# EAGLE design mainboard (EAGLE 9.6.2)
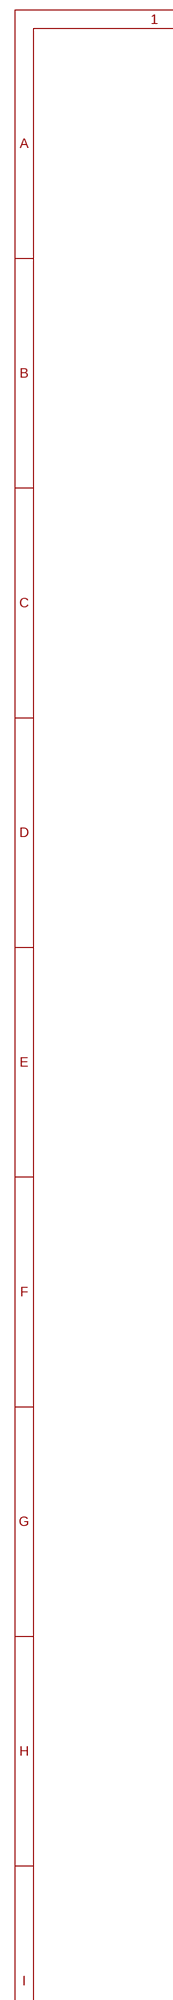
[diagram p0: schematic, sheet 1, part 1 of 2]
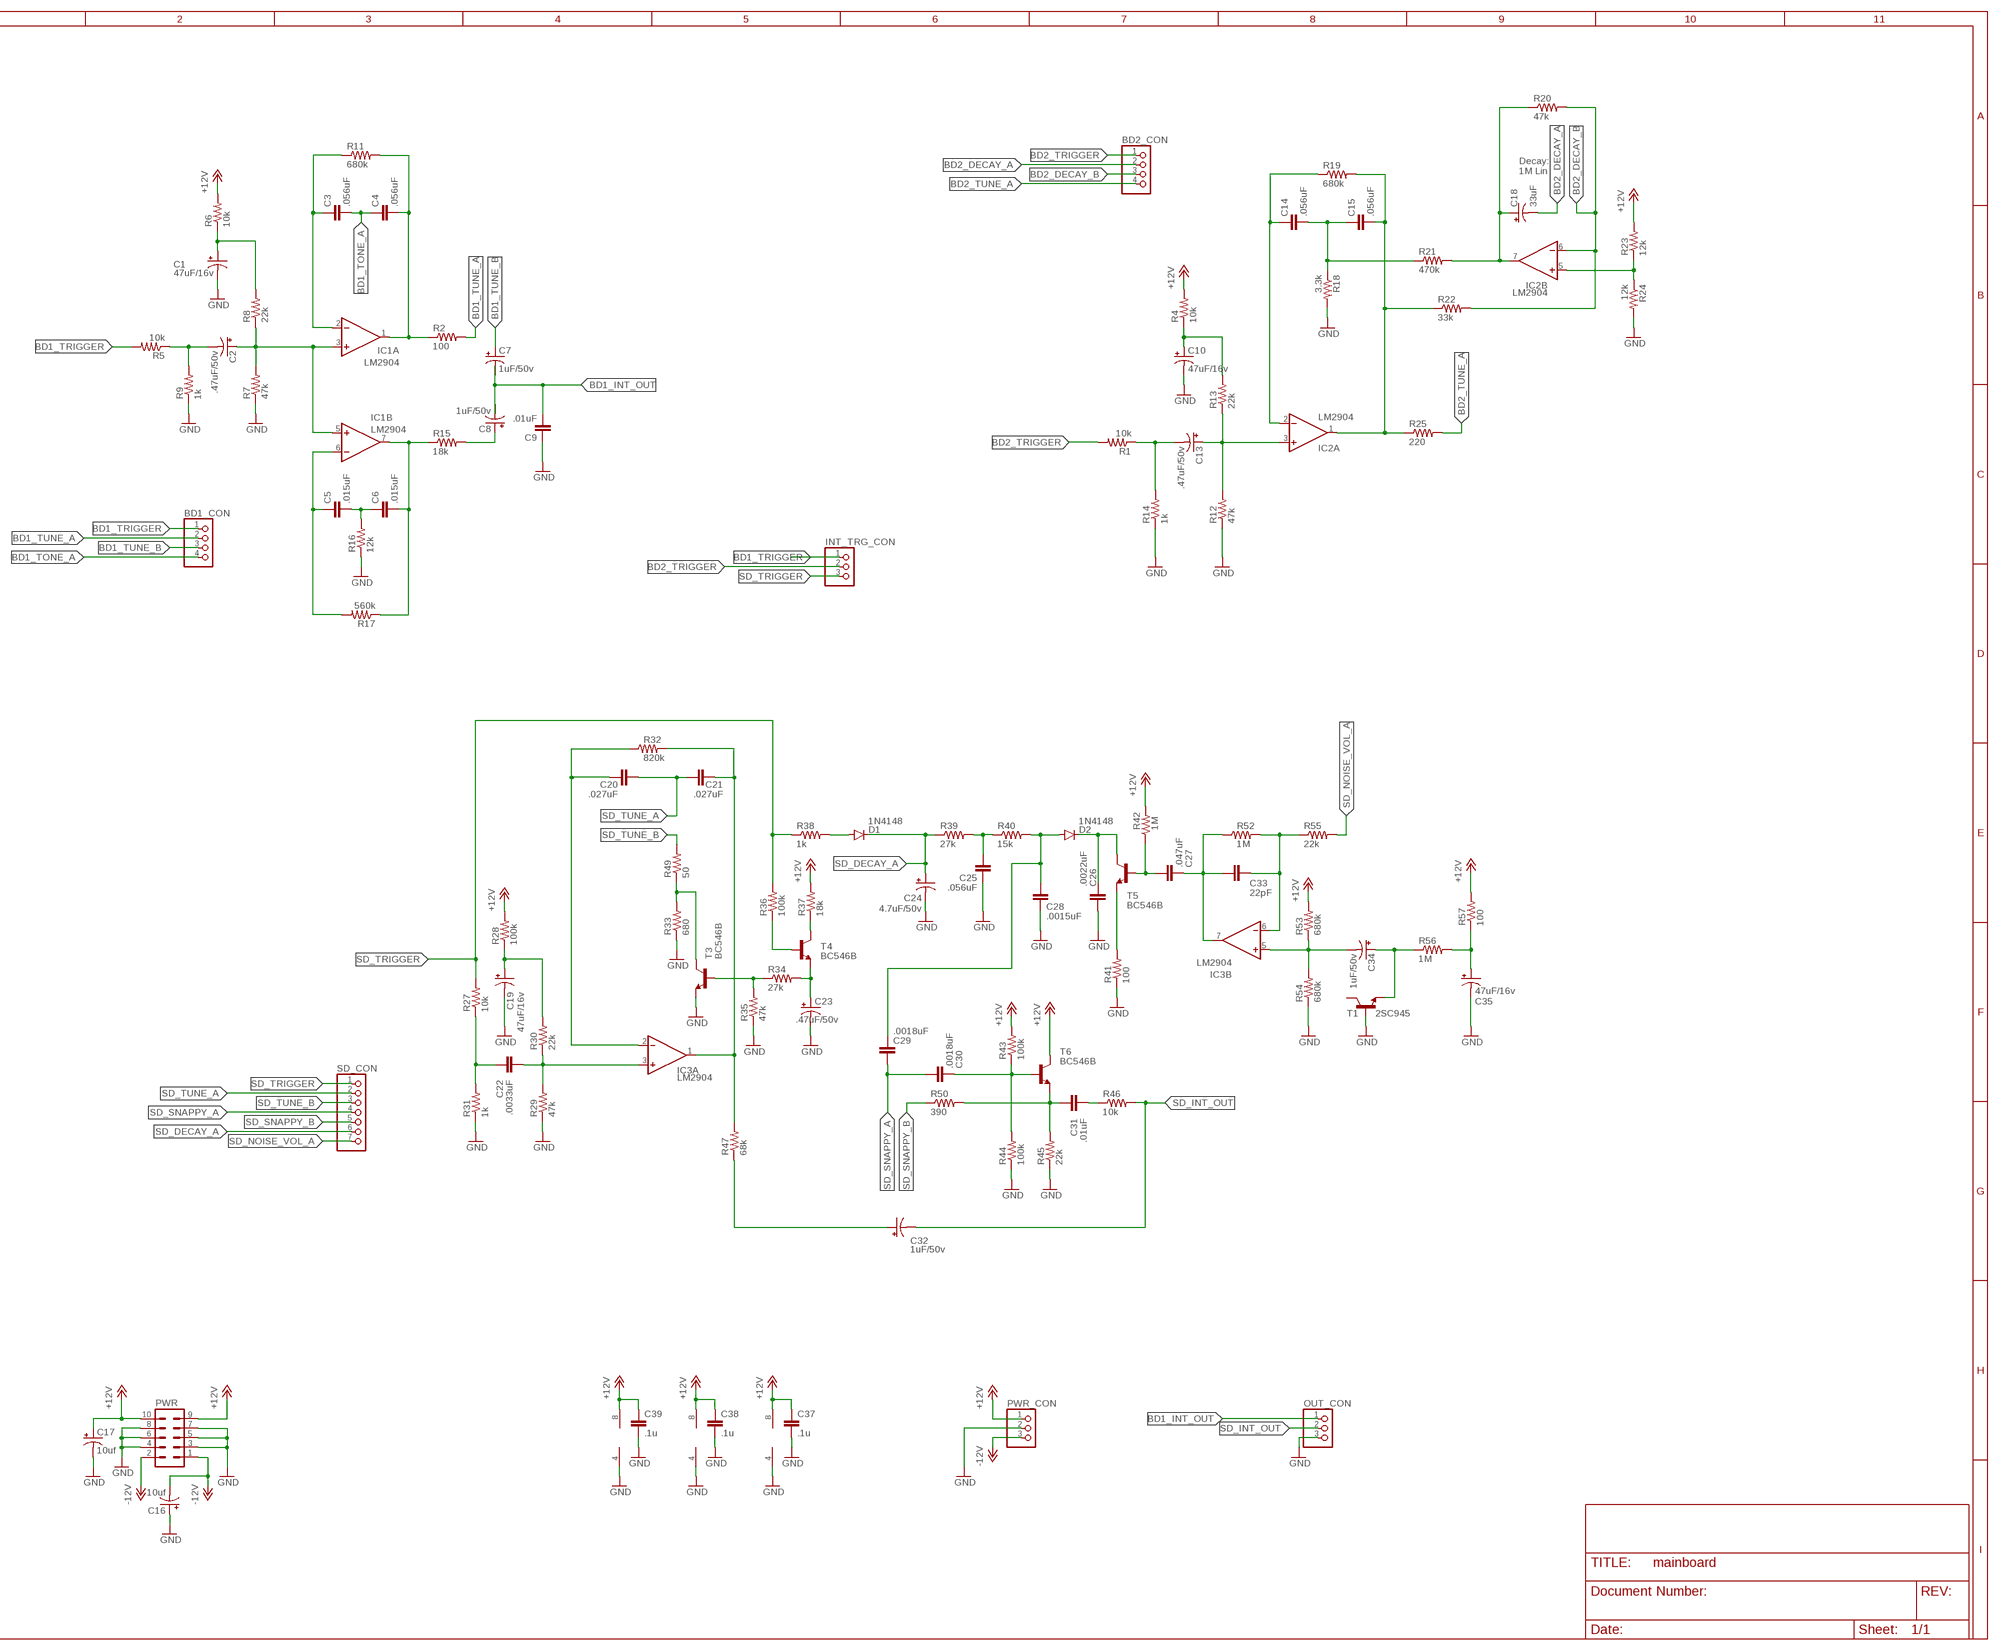
[diagram p1: schematic, sheet 1, part 2 of 2]

## Parts
BD1_CON  PINHD-1X4  [1X04]
BD2_CON  PINHD-1X4  [1X04]
C1  47uF/16v  CPOL-USE2.5-5  [E2,5-5]
C2  .47uF/50v  CPOL-USE2.5-5  [E2,5-5]
C3  .056uF  C-EU050-024X044  [C050-024X044]
C4  .056uF  C-EU050-024X044  [C050-024X044]
C5  .015uF  C-EU050-024X044  [C050-024X044]
C6  .015uF  C-EU050-024X044  [C050-024X044]
C7  1uF/50v  CPOL-USE2.5-5  [E2,5-5]
C8  1uF/50v  CPOL-USE2.5-5  [E2,5-5]
C9  .01uF  C-EU050-024X044  [C050-024X044]
C10  47uF/16v  CPOL-USE2.5-6  [E2,5-6]
C13  .47uF/50v  CPOL-USE2.5-6  [E2,5-6]
C14  .056uF  C-EU050-024X044  [C050-024X044]
C15  .056uF  C-EU050-024X044  [C050-024X044]
C16  10uf  CPOL-USE2.5-5  [E2,5-5]
C17  10uf  CPOL-USE2.5-5  [E2,5-5]
C18  33uF  CPOL-USE2.5-5  [E2,5-5]
C19  47uF/16v  CPOL-USE2.5-6  [E2,5-6]
C20  .027uF  C-EU050-024X044  [C050-024X044]
C21  .027uF  C-EU050-024X044  [C050-024X044]
C22  .0033uF  C-EU050-024X044  [C050-024X044]
C23  .47uF/50v  CPOL-USE2.5-6  [E2,5-6]
C24  4.7uF/50v  CPOL-USE2.5-6  [E2,5-6]
C25  .056uF  C-EU050-024X044  [C050-024X044]
C26  .0022uF  C-EU050-024X044  [C050-024X044]
C27  .047uF  C-EU050-024X044  [C050-024X044]
C28  .0015uF  C-EU050-024X044  [C050-024X044]
C29  .0018uF  C-EU050-024X044  [C050-024X044]
C30  .0018uF  C-EU050-024X044  [C050-024X044]
C31  .01uF  C-EU050-024X044  [C050-024X044]
C32  1uF/50v  CPOL-USE2.5-6  [E2,5-6]
C33  22pF  C-EU050-024X044  [C050-024X044]
C34  1uF/50v  CPOL-USE2.5-5  [E2,5-5]
C35  47uF/16v  CPOL-USE2.5-5  [E2,5-5]
C37  .1u  C-EU050-024X044  [C050-024X044]
C38  .1u  C-EU050-024X044  [C050-024X044]
C39  .1u  C-EU050-024X044  [C050-024X044]
D1  1N4148  1N4148DO35-7  [DO35-7]
D2  1N4148  1N4148DO35-7  [DO35-7]
IC1  LM2904  TL072P  [DIL08]
IC2  LM2904  TL072P  [DIL08]
IC3  LM2904  TL072P  [DIL08]
INT_TRG_CON  PINHD-1X3  [1X03]
OUT_CON  PINHD-1X3  [1X03]
PWR  ML10  [ML10]
PWR_CON  PINHD-1X3  [1X03]
R1  10k  R-US_0207/7  [0207/7]
R2  100  R-US_0207/7  [0207/7]
R4  10k  R-US_0207/7  [0207/7]
R5  10k  R-US_0207/7  [0207/7]
R6  10k  R-US_0207/7  [0207/7]
R7  47k  R-US_0207/7  [0207/7]
R8  22k  R-US_0207/7  [0207/7]
R9  1k  R-US_0207/7  [0207/7]
R11  680k  R-US_0207/7  [0207/7]
R12  47k  R-US_0207/7  [0207/7]
R13  22k  R-US_0207/7  [0207/7]
R14  1k  R-US_0207/7  [0207/7]
R15  18k  R-US_0207/7  [0207/7]
R16  12k  R-US_0207/7  [0207/7]
R17  560k  R-US_0207/7  [0207/7]
R18  3.3k  R-US_0207/7  [0207/7]
R19  680k  R-US_0207/7  [0207/7]
R20  47k  R-US_0207/7  [0207/7]
R21  470k  R-US_0207/7  [0207/7]
R22  33k  R-US_0207/7  [0207/7]
R23  12k  R-US_0207/7  [0207/7]
R24  12k  R-US_0207/7  [0207/7]
R25  220  R-US_0207/7  [0207/7]
R27  10k  R-US_0207/7  [0207/7]
R28  100k  R-US_0207/7  [0207/7]
R29  47k  R-US_0207/7  [0207/7]
R30  22k  R-US_0207/7  [0207/7]
R31  1k  R-US_0207/7  [0207/7]
R32  820k  R-US_0207/2V  [0207/2V]
R33  680  R-US_0207/7  [0207/7]
R34  27k  R-US_0207/7  [0207/7]
R35  47k  R-US_0207/7  [0207/7]
R36  100k  R-US_0207/7  [0207/7]
R37  18k  R-US_0207/7  [0207/7]
R38  1k  R-US_0207/7  [0207/7]
R39  27k  R-US_0207/7  [0207/7]
R40  15k  R-US_0207/7  [0207/7]
R41  100  R-US_0207/7  [0207/7]
R42  1M  R-US_0207/7  [0207/7]
R43  100k  R-US_0207/7  [0207/7]
R44  100k  R-US_0207/7  [0207/7]
R45  22k  R-US_0207/7  [0207/7]
R46  10k  R-US_0207/7  [0207/7]
R47  68k  R-US_0207/7  [0207/7]
R49  50  R-US_0207/7  [0207/7]
R50  390  R-US_0207/7  [0207/7]
R52  1M  R-US_0207/7  [0207/7]
R53  680k  R-US_0207/7  [0207/7]
R54  680k  R-US_0207/7  [0207/7]
R55  22k  R-US_0207/7  [0207/7]
R56  1M  R-US_0207/7  [0207/7]
R57  100  R-US_0207/7  [0207/7]
SD_CON  PINHD-1X7  [1X07]
T1  2SC945  [TO92-ECB]
T3  BC546B  BC546-NPN-TO92-CBE  [TO92-CBE]
T4  BC546B  BC546-NPN-TO92-CBE  [TO92-CBE]
T5  BC546B  BC546-NPN-TO92-CBE  [TO92-CBE]
T6  BC546B  BC546-NPN-TO92-CBE  [TO92-CBE]

## Nets
+12V: C17.+ C37.1 C38.1 C39.1 IC1.8(P:V+) IC2.8(P:V+) IC3.8(P:V+) PWR.9 PWR.10 PWR_CON.1 R4.2 R6.2 R23.2 R28.2 R37.2 R42.2 R43.2 R53.2 R57.2 T6.C
-12V: C16.- PWR.1 PWR.2 PWR_CON.3
BD1_INT_OUT: C7.- C8.- C9.2 OUT_CON.1
BD1_TONE_A: BD1_CON.4 C3.2 C4.1
BD1_TRIGGER: BD1_CON.1 INT_TRG_CON.1 R5.2
BD1_TUNE_A: BD1_CON.2 R2.2
BD1_TUNE_B: BD1_CON.3 C7.+
BD2_DECAY_A: BD2_CON.2 C18.-
BD2_DECAY_B: BD2_CON.3 IC2.6(B:-IN) R20.2 R22.2
BD2_TRIGGER: BD2_CON.1 INT_TRG_CON.2 R1.2
BD2_TUNE_A: BD2_CON.4 R25.2
GND: C1.- C9.1 C10.- C16.+ C17.- C19.- C23.- C24.- C25.1 C26.1 C28.1 C35.- C37.2 C38.2 C39.2 IC1.4(P:V-) IC2.4(P:V-) IC3.4(P:V-) OUT_CON.3 PWR.3 PWR.4 PWR.5 PWR.6 PWR.7 PWR.8 PWR_CON.2 R7.1 R9.1 R12.1 R14.1 R16.1 R18.2 R24.2 R29.1 R31.1 R33.1 R35.1 R41.1 R44.1 R45.1 R54.1 T1.B T3.E
N$4: C13.- R1.1 R14.2
N$5: C2.- R5.1 R9.2
N$6: C2.+ IC1.3(A:+IN) IC1.5(B:+IN) R7.2 R8.1
N$7: C1.+ R6.1 R8.2
N$8: C5.2 C6.1 R16.2
N$9: C3.1 IC1.2(A:-IN) R11.1
N$11: C13.+ IC2.3(A:+IN) R12.2 R13.1
N$12: C10.+ R4.1 R13.2
N$13: C6.2 IC1.7(B:OUT) R15.1 R17.1
N$14: C5.1 IC1.6(B:-IN) R17.2
N$15: C4.2 IC1.1(A:OUT) R2.1 R11.2
N$17: C8.+ R15.2
N$19: C14.1 IC2.2(A:-IN) R19.1
N$22: C14.2 C15.1 R18.1 R21.1
N$23: C15.2 IC2.1(A:OUT) R19.2 R22.1 R25.1
N$24: C18.+ IC2.7(B:OUT) R20.1 R21.2
N$25: IC2.5(B:+IN) R23.1 R24.1
N$30: C22.1 R27.1 R31.2
N$31: C22.2 IC3.3(A:+IN) R29.2 R30.1
N$32: C19.+ R28.1 R30.2
N$33: C20.1 IC3.2(A:-IN) R32.1
N$34: C21.2 IC3.1(A:OUT) R32.2 R47.2
N$36: R33.2 R49.1 T3.C
N$37: R34.1 R35.2 T3.B
N$38: C23.+ R34.2 T4.E
N$39: R36.1 T4.B
N$40: R37.1 T4.C
N$41: D1.A R38.2
N$42: C25.2 R39.2 R40.1
N$43: C28.2 C29.1 D2.A R40.2
N$44: C26.2 D2.C T5.C
N$45: R41.2 T5.E
N$46: C27.1 R42.1 T5.B
N$47: C31.1 R45.2 R50.2 T6.E
N$49: C31.2 R46.1
N$50: C32.+ R47.1
N$55: C30.2 R43.1 R44.2 T6.B
N$58: C27.2 C33.1 IC3.7(B:OUT) R52.1
N$59: C33.2 IC3.6(B:-IN) R52.2 R55.1
N$60: C34.- IC3.5(B:+IN) R53.1 R54.2
N$61: C34.+ R56.1 T1.E
N$62: C35.+ R56.2 R57.1
SD_DECAY_A: C24.+ D1.C R39.1 SD_CON.6
SD_INT_OUT: C32.- OUT_CON.2 R46.2
SD_NOISE_VOL_A: R55.2 SD_CON.7
SD_SNAPPY_A: C29.2 C30.1 SD_CON.4
SD_SNAPPY_B: R50.1 SD_CON.5
SD_TRIGGER: INT_TRG_CON.3 R27.2 R36.2 R38.1 SD_CON.1
SD_TUNE_A: C20.2 C21.1 SD_CON.2
SD_TUNE_B: R49.2 SD_CON.3
Unconnected: T1.C

## Notes on the sheet
- Decay: 
  1M Lin

## Library data of the parts
BD1_CON BD2_CON = pinhead:PINHD-1X4: PIN HEADER
C1 C2 C7 C10 C13 C16 C17 C19 C23 C24 C32 C34 C35 = resistor:CPOL-US: POLARIZED CAPACITOR, American symbol
C3-C6 C9 C14 C15 C20-C22 C25-C31 C33 C37-C39 = resistor:C-EU: CAPACITOR, European symbol
C8 C18 = rcl:CPOL-US: POLARIZED CAPACITOR, American symbol; SPICEPREFIX: C
D1 D2 = diode:1N4148: DIODE high speed (Philips)
IC1-IC3 = TomW:TL072: OP AMP
INT_TRG_CON OUT_CON PWR_CON = pinhead:PINHD-1X3: PIN HEADER
PWR = con-ml:ML10: HARTING; OC_FARNELL: unknown; OC_NEWARK: unknown
R1 R2 R4-R9 R11-R25 R27-R31 R33-R47 R49 R50 R52-R57 = rcl:R-US_: RESISTOR, American symbol; SPICEPREFIX: R
R32 = resistor:R-US_: RESISTOR, American symbol
SD_CON = pinhead:PINHD-1X7: PIN HEADER
T1 = transistor:2SC945: NPN Silicon Epitaxial Planar Transistor Source: SEMTECH ELECTRONICS LTD. ... 2SC945 2.pdf
T3-T6 = transistor:*-NPN-: NPN Transistror BF959 corrected 2008.03.06

## Board
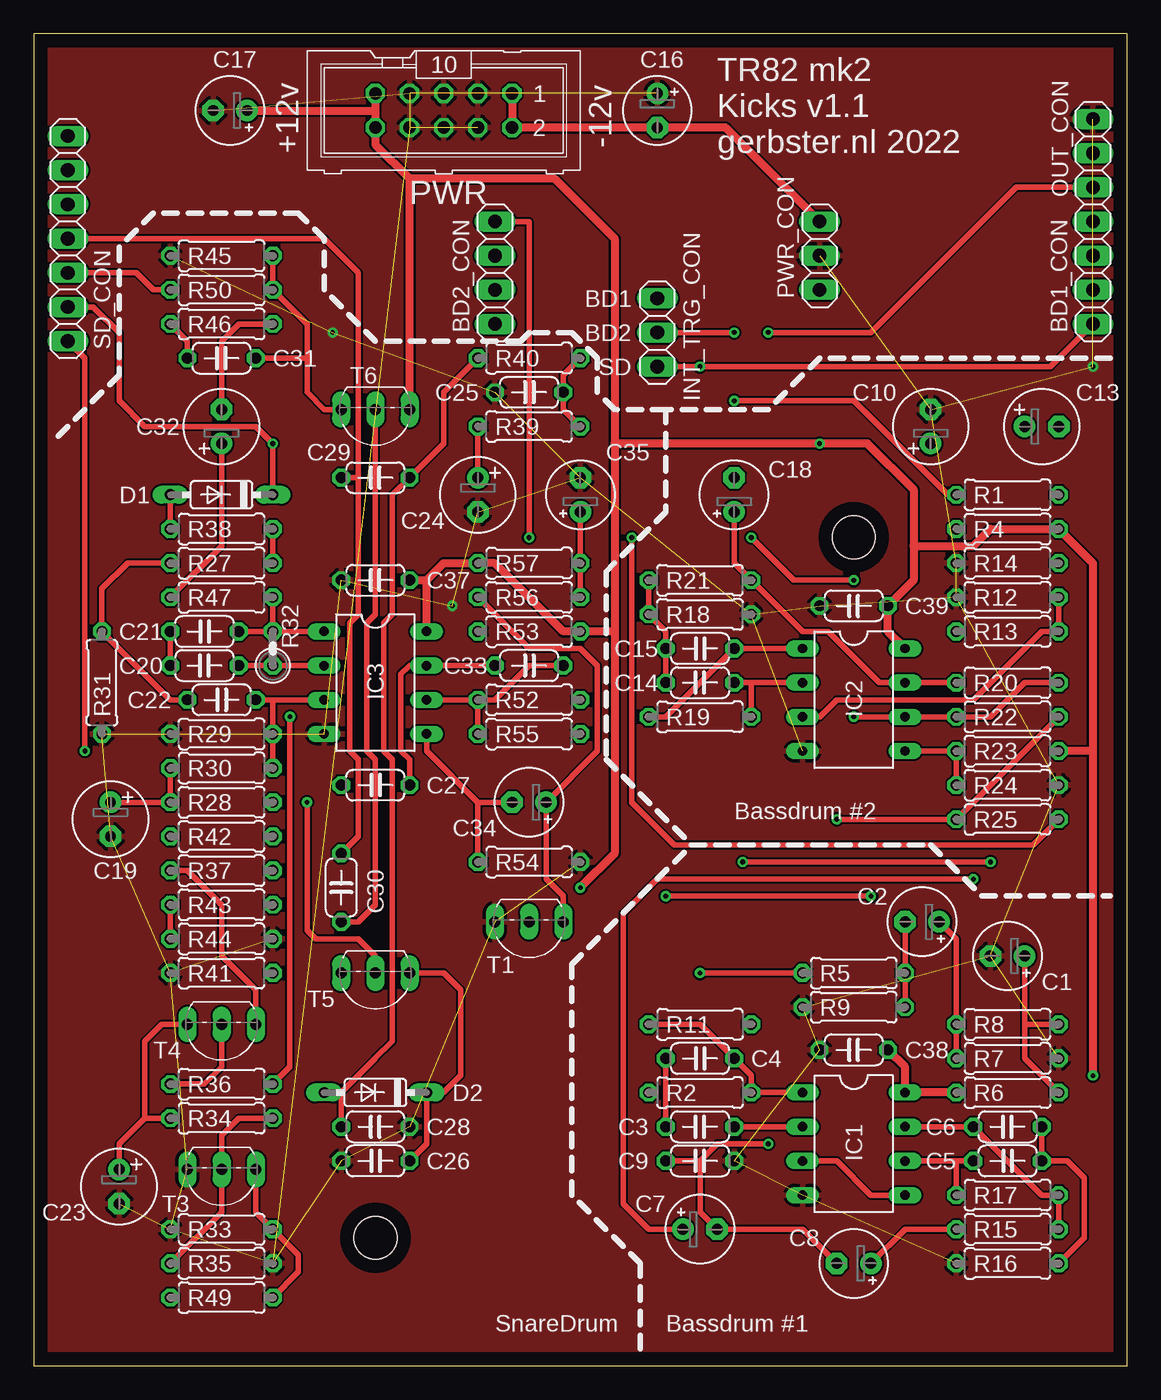
[diagram p2: board, top side]
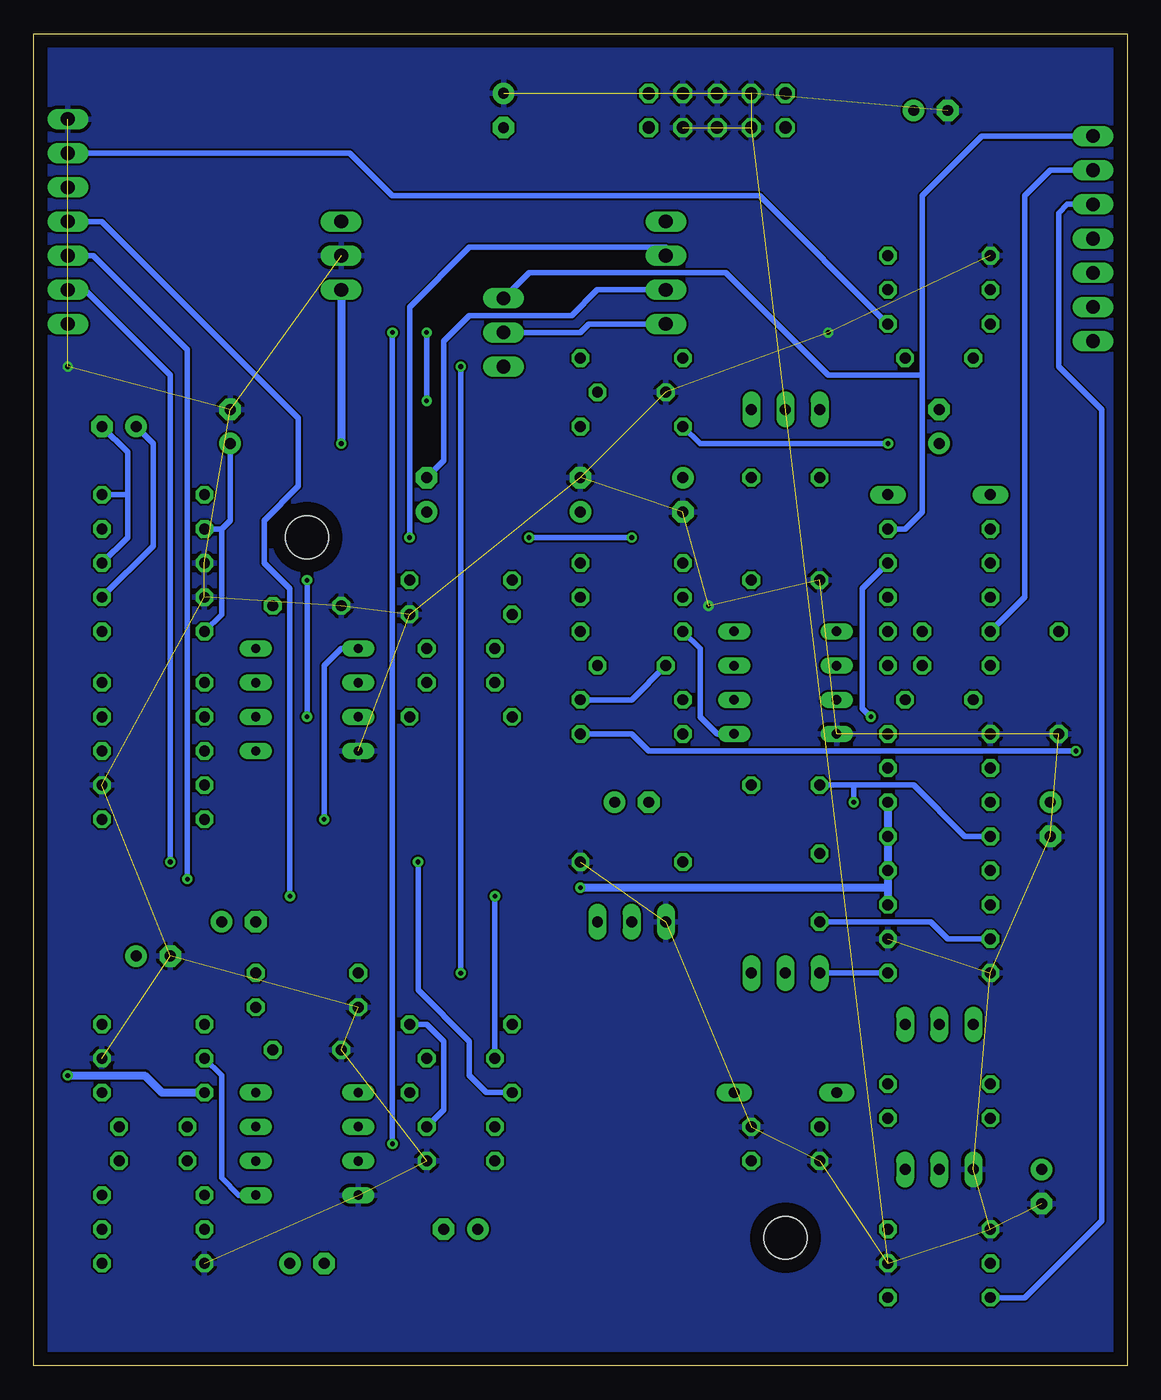
[diagram p3: board, bottom side, seen from below]

Size 81.28 x 99.06 mm. Coordinates in mm from the lower left corner, seen from the top.
Outline: 81.28,99.06 0,99.06 0,0 81.28,0 81.28,99.06
Copper layers (1*16): Top 0.035mm / dielectric 1.5mm / Bottom 0.035mm
Design rules "default": minimum track width 6mil, minimum drill 0.35mm, track to track 6mil, track to pad 6mil, pad to pad 6mil, via to via 6mil, smd to smd 6mil, copper to edge 40mil, drill to drill 6mil, minimum pad ring 10mil, minimum via ring 8mil, stop-mask expansion 4mil, vias tented up to drill 0mil, thermal gap 10mil
Holes 3.2 mm at 60.96,61.59 25.4,9.53

### Footprints (pad centres in the part's own frame; a part is rotated, then mirrored left to right if it is on the bottom)
1X04 = drill 1.016 long: 1 -3.81,0; 2 -1.27,0; 3 1.27,0; 4 3.81,0
E2,5-5 = drill 0.813 pad 1.6: + -1.27,0 | drill 0.813 pad 1.6 octagon: - 1.27,0
C050-024X044 = drill 0.813 octagon: 1 -2.54,0; 2 2.54,0
E2,5-6 = drill 0.813 pad 1.6: + -1.27,0 | drill 0.813 pad 1.6 octagon: - 1.27,0
DO35-7 = drill 0.813 long: A 3.81,0; C -3.81,0
DIL08 = drill 0.7 long: 1 -3.81,-3.81; 2 -1.27,-3.81; 3 1.27,-3.81; 4 3.81,-3.81; 5 3.81,3.81; 6 1.27,3.81; 7 -1.27,3.81; 8 -3.81,3.81
1X03 = drill 1.016 long: 1 -2.54,0; 2 0,0; 3 2.54,0
ML10 = drill 0.914 octagon: 1 -5.08,-1.27; 2 -5.08,1.27; 3 -2.54,-1.27; 4 -2.54,1.27; 5 0,-1.27; 6 0,1.27; 7 2.54,-1.27; 8 2.54,1.27; 9 5.08,-1.27; 10 5.08,1.27
0207/7 = drill 0.813 octagon: 1 -3.81,0; 2 3.81,0
0207/2V = drill 0.813 octagon: 1 -1.27,0; 2 1.27,0
1X07 = drill 1.016 long: 1 -7.62,0; 2 -5.08,0; 3 -2.54,0; 4 0,0; 5 2.54,0; 6 5.08,0; 7 7.62,0
TO92-ECB = drill 0.813 long: B 2.54,0; C 0,0; E -2.54,0
TO92-CBE = drill 0.813 long: B 0,0; C -2.54,0; E 2.54,0

### Placement (x,y rotation side)
BD1_CON  78.74,81.28 90 top
BD2_CON  34.29,81.28 90 top
C1  72.39,30.48 180 top
C2  66.04,33.02 180 top
C3  49.53,17.78 180 top
C4  49.53,22.86 0 top
C5  72.39,15.24 0 top
C6  72.39,17.78 180 top
C7  49.53,10.16 0 top
C8  60.96,7.62 180 top
C9  49.53,15.24 180 top
C10  66.67,69.85 90 top
C13  74.93,69.85 0 top
C14  49.53,50.8 180 top
C15  49.53,53.34 0 top
C16  46.35,93.34 270 top
C17  14.61,93.34 180 top
C18  52.07,64.77 90 top
C19  5.71,40.64 270 top
C20  12.7,52.07 180 top
C21  12.7,54.61 0 top
C22  13.97,49.53 0 top
C23  6.35,13.34 270 top
C24  33.02,64.77 270 top
C25  36.83,72.39 0 top
C26  25.4,15.24 0 top
C27  25.4,43.18 0 top
C28  25.4,17.78 180 top
C29  25.4,66.04 180 top
C30  22.86,35.56 270 top
C31  13.97,74.93 180 top
C32  13.97,69.85 90 top
C33  36.83,52.07 0 top
C34  36.83,41.91 180 top
C35  40.64,64.77 90 top
C37  25.4,58.42 180 top
C38  60.96,23.5 180 top
C39  60.96,56.52 180 top
D1  13.97,64.77 180 top
D2  25.4,20.32 180 top
IC1  60.96,16.51 270 top
IC2  60.96,49.53 270 top
IC3  25.4,50.8 270 top
INT_TRG_CON  46.35,76.83 90 top
OUT_CON  78.74,90.17 90 top
PWR  30.48,93.34 180 top
PWR_CON  58.42,82.55 90 top
R1  72.39,64.77 180 top
R2  49.53,20.32 180 top
R4  72.39,62.23 0 top
R5  60.96,29.21 180 top
R6  72.39,20.32 180 top
R7  72.39,22.86 180 top
R8  72.39,25.4 0 top
R9  60.96,26.67 0 top
R11  49.53,25.4 180 top
R12  72.39,57.15 0 top
R13  72.39,54.61 180 top
R14  72.39,59.69 0 top
R15  72.39,10.16 180 top
R16  72.39,7.62 0 top
R17  72.39,12.7 180 top
R18  49.53,55.88 0 top
R19  49.53,48.26 180 top
R20  72.39,50.8 0 top
R21  49.53,58.42 0 top
R22  72.39,48.26 180 top
R23  72.39,45.72 0 top
R24  72.39,43.18 0 top
R25  72.39,40.64 0 top
R27  13.97,59.69 0 top
R28  13.97,41.91 0 top
R29  13.97,46.99 0 top
R30  13.97,44.45 180 top
R31  5.08,50.8 90 top
R32  17.78,53.34 90 top
R33  13.97,10.16 0 top
R34  13.97,18.41 180 top
R35  13.97,7.62 180 top
R36  13.97,20.95 0 top
R37  13.97,36.83 0 top
R38  13.97,62.23 180 top
R39  36.83,69.85 0 top
R40  36.83,74.93 180 top
R41  13.97,29.21 0 top
R42  13.97,39.37 0 top
R43  13.97,34.29 0 top
R44  13.97,31.75 180 top
R45  13.97,82.55 0 top
R46  13.97,77.47 0 top
R47  13.97,57.15 0 top
R49  13.97,5.08 180 top
R50  13.97,80.01 0 top
R52  36.83,49.53 180 top
R53  36.83,54.61 0 top
R54  36.83,37.47 180 top
R55  36.83,46.99 0 top
R56  36.83,57.15 0 top
R57  36.83,59.69 180 top
SD_CON  2.54,83.82 270 top
T1  36.83,33.02 180 top
T3  13.97,14.61 180 top
T4  13.97,25.4 180 top
T5  25.4,29.21 180 top
T6  25.4,71.12 180 top

### Tracks (layer width: path | path; a pad name or v marks a point on that pad's centre or on a via)
+12V  (via drill 0.35)
  Top 0.61: R6.2 IC1.8 64.77,22.23 C38.1 | 27.94,88.27 25.4,90.81 PWR.10 25.4,93.34 | 27.94,88.27 38.73,88.27 43.18,83.82 43.18,68.58 | 43.18,68.58 43.18,54.61 | 43.18,54.61 R53.2 39.37,54.61 34.29,59.69 R57.2 30.48,59.69 29.21,58.42 | IC3.8 29.21,58.42 | C37.1 29.21,58.42 | T6.C 27.94,88.27 | IC2.8 63.5,54.61 C39.1 65.41,58.42 65.41,60.96 | 65.41,60.96 65.41,65.17 61.98,68.58 v58.42,68.58 43.18,68.58 | 43.18,54.61 43.18,38.1 v40.64,35.56 | 65.41,60.96 69.85,60.96 71.12,62.23 R4.2 78.74,59.69 78.74,45.72 | 78.74,45.72 R23.2 | 78.74,45.72 v78.74,21.59 | PWR.9 25.4,93.34 | C17.+ 25.4,93.34
  Bottom 0.61: v40.64,35.56 17.78,35.56 | 17.78,35.56 R43.2 | v78.74,21.59 73.03,21.59 71.75,20.32 R6.2 | PWR_CON.1 v58.42,68.58 | R28.2 R42.2 R37.2 17.78,35.56
  other vias: 64.77,53.34
-12V
  Top 0.61: PWR.1 PWR.2 C16.- 51.44,92.08 PWR_CON.3
BD1_INT_OUT  (via drill 0.35)
  Top 0.406: C8.- 57.15,10.16 C7.- 49.53,11.43 49.53,15.24 | C9.2 49.53,15.24 | OUT_CON.1 73.03,87.63 62.23,76.83 v54.61,76.83 | v54.61,16.51 50.8,16.51 49.53,15.24
  Bottom 0.406: v54.61,76.83 v54.61,16.51
BD1_TONE_A  (via drill 0.35)
  Top 0.406: C3.2 C4.1 | v62.23,34.92 v46.99,34.92
  Bottom 0.406: v62.23,34.92 62.23,57.78 64.14,59.69 64.14,62.87 61.59,65.41 61.59,70.48 76.2,85.09 BD1_CON.4 | v46.99,34.92 C4.1
BD1_TRIGGER  (via drill 0.35)
  Top 0.406: R5.2 v49.53,29.21 | INT_TRG_CON.1 v49.53,74.3 75.56,74.3 BD1_CON.1
  Bottom 0.406: v49.53,29.21 v49.53,74.3
BD1_TUNE_A  (via drill 0.35)
  Top 0.406: v71.12,37.47 v52.7,37.47
  Bottom 0.406: R2.2 47.62,20.32 48.9,21.59 48.9,24.13 52.7,27.94 v52.7,37.47 | BD1_CON.2 77.47,80.01 71.12,73.66 v71.12,37.47
BD1_TUNE_B  (via drill 0.35)
  Top 0.406: C7.+ 45.72,10.16 43.81,12.06 43.81,33.66 46.35,36.2 v69.85,36.2
  Bottom 0.406: BD1_CON.3 76.83,82.55 69.85,75.56 v69.85,36.2
BD2_DECAY_A
  Bottom 0.406: BD2_CON.2 39.37,80.01 41.27,78.11 48.9,78.11 50.8,76.2 50.8,67.31 C18.-
BD2_DECAY_B  (via drill 0.35)
  Top 0.406: R20.2 73.66,50.8 71.12,48.26 R22.2 IC2.6 v60.96,48.26 | v53.34,61.59 56.52,58.42 v60.96,58.42
  Bottom 0.406: BD2_CON.3 34.29,83.19 48.9,83.19 53.34,78.74 v53.34,61.59 | v60.96,58.42 v60.96,48.26
BD2_TRIGGER  (via drill 0.35)
  Top 0.406: INT_TRG_CON.2 v52.07,76.83 | v52.07,71.75 60.96,71.75 67.94,64.77 R1.2
  Bottom 0.406: BD2_CON.1 40.01,77.47 40.64,76.83 INT_TRG_CON.2 | v52.07,76.83 v52.07,71.75
BD2_TUNE_A  (via drill 0.35)
  Top 0.406: R25.2 74.3,38.73 47.62,38.73 44.45,41.91 v44.45,61.59 | v36.83,61.59 36.83,85.09 BD2_CON.4
  Bottom 0.406: v44.45,61.59 v36.83,61.59
GND  (via drill 0.35)  (45 unrouted)
  other vias: 78.74,74.3 31.11,56.52 22.23,76.83
  pour Top: 81.28,0 0,0 0,99.06 81.28,99.06
  pour Bottom: 0,99.06 0,0 81.28,0 81.28,99.06
N$4
  Bottom 0.406: R14.2 74.3,61.59 74.3,64.77 | R1.1 74.3,64.77 | 74.3,64.77 74.3,67.94 C13.-
N$5
  Top 0.406: R9.2 R5.1 C2.-
N$6
  Top 0.406: IC1.5 62.23,12.7 59.69,15.24 IC1.3 | R7.2 R8.1 68.58,31.75 C2.+
  Bottom 0.406: IC1.5 66.04,12.7 67.31,13.97 67.31,21.59 R7.2
N$7
  Top 0.406: R6.1 73.66,22.86 73.66,25.4 | 73.66,25.4 R8.2 | 73.66,25.4 C1.+
N$8
  Top 0.406: R16.2 78.11,9.53 78.11,13.97 76.83,15.24 C5.2 C6.1
N$9
  Top 0.406: IC1.2 C3.1
  Bottom 0.406: C3.1 50.8,19.05 50.8,24.13 52.07,25.4 R11.1
N$11
  Top 0.406: R12.2 R13.1 74.93,54.61 69.85,49.53 59.69,49.53 58.42,48.26 IC2.3
  Bottom 0.406: C13.+ 72.39,68.58 72.39,60.96 R12.2
N$12
  Bottom 0.406: R13.2 67.31,55.88 67.31,62.23 | 67.31,62.23 R4.1 | C10.+ 66.67,62.87 67.31,62.23
N$13
  Top 0.406: IC1.7 C6.2 74.93,12.7 R17.1 R15.1
N$14
  Top 0.406: IC1.6 68.58,15.24 | 68.58,15.24 C5.1 | R17.2 68.58,15.24
N$15
  Top 0.406: IC1.1 R2.1 53.34,21.59 C4.2 49.53,25.4 R11.2
N$17
  Top 0.406: R15.2 64.77,10.16 C8.+
N$19
  Top 0.406: C14.1 53.34,50.8 | 53.34,50.8 IC2.2 | 53.34,50.8 R19.1
N$22
  Top 0.406: C14.2 C15.1 46.99,54.61 R18.1 R21.1
N$23  (via drill 0.35)
  Top 0.406: R22.1 R25.1 v59.69,40.64 | IC2.1 C15.2 46.99,48.26 R19.2
  Bottom 0.406: v59.69,40.64 59.69,52.07 58.42,53.34 IC2.1
N$24
  Top 0.406: R20.1 IC2.7 62.87,50.8 59.05,54.61 57.15,54.61 R21.2 52.07,59.69 C18.+
N$25
  Top 0.406: IC2.5 R23.1 R24.1
N$30
  Top 0.406: C22.1 10.16,49.53 R31.2 5.08,57.78 6.99,59.69 R27.1
N$31
  Top 0.406: IC3.3 17.78,49.53 | 17.78,49.53 C22.2 | 17.78,49.53 R29.2 R30.1
N$32
  Top 0.406: R30.2 R28.1 C19.+
N$33
  Top 0.406: IC3.2 R32.1 C20.1
N$34
  Top 0.406: IC3.1 R32.2 | R32.2 R47.2 | R32.2 C21.2
N$36
  Top 0.406: R49.1 19.68,6.99 19.68,8.26 R33.2 16.51,11.43 T3.C
N$37
  Top 0.406: R34.1 15.24,18.41 13.97,17.14 T3.B 13.97,11.43 R35.2
N$38
  Top 0.406: C23.+ 6.35,16.51 8.26,18.41 | R34.2 8.26,18.41 | 8.26,18.41 8.26,24.13 9.53,25.4 T4.E
N$39
  Top 0.406: T4.B 13.97,22.23 12.7,20.95 R36.1
N$40
  Top 0.406: T4.C 16.51,27.94 13.97,30.48 13.97,34.29 11.43,36.83 R37.1
N$41
  Top 0.406: R38.2 D1.A
N$42
  Top 0.406: R39.2 39.37,71.12 C25.2 39.37,73.66 R40.1
N$43
  Top 0.406: C28.2 22.86,20.32 | 22.86,20.32 D2.A | R40.2 30.48,72.39 30.48,68.58 C29.1 26.67,64.77 26.67,55.88 26.04,55.24 26.04,45.72 26.67,45.09 26.67,24.13 25.4,22.89 25.4,22.86 22.86,20.32
N$44
  Top 0.406: C26.2 29.21,16.51 D2.C 30.48,20.32 31.75,21.59 31.75,27.94 30.48,29.21 T5.C
N$45
  Bottom 0.406: T5.E R41.2
N$46  (via drill 0.35)
  Top 0.406: T5.B 25.4,30.48 24.13,31.75 20.95,31.75 20.32,32.38 v20.32,41.91
  Bottom 0.406: R42.1 12.06,39.37 15.88,43.18 20.32,43.18 | 20.32,43.18 C27.1 | v20.32,41.91 20.32,43.18
N$47
  Top 0.406: R45.2 R50.2 20.32,77.47 20.32,74.93 | 20.32,74.93 20.32,72.39 21.59,71.12 T6.E | C31.1 20.32,74.93
N$49
  Top 0.406: R46.1 11.43,76.2 C31.2
N$50
  Top 0.406: R47.1 13.97,60.96 C32.+
N$55
  Top 0.406: R44.2 R43.1 | C30.2 24.13,33.02 25.4,34.29 25.4,45.09 24.77,45.72 24.77,55.24 25.4,55.88 T6.B
  Bottom 0.406: R44.2 13.34,31.75 14.61,33.02 C30.2
N$58
  Top 0.406: C33.1 IC3.7 27.94,52.07 27.3,51.44 27.3,45.72 27.94,45.09 C27.2
  Bottom 0.406: R52.1 36.83,49.53 C33.1
N$59
  Top 0.406: IC3.6 R52.2 | R52.2 R55.1 | R52.2 34.29,49.53 36.83,52.07 C33.2
N$60
  Top 0.406: C34.- 33.02,41.91 | 33.02,41.91 29.21,45.72 IC3.5 | R54.2 33.02,41.91
  Bottom 0.406: IC3.5 30.48,46.99 31.75,48.26 31.75,53.34 R53.1
N$61
  Top 0.406: T1.E 39.37,34.92 38.1,36.2 C34.+ 41.91,45.72 41.91,52.07 40.64,53.34 36.83,53.34 R56.1
N$62
  Top 0.406: R56.2 R57.1 C35.+
SD_DECAY_A  (via drill 0.35)
  Top 0.406: C24.+ R39.1 | D1.C v17.78,68.58 16.51,69.85 8.26,69.85 6.35,71.75 6.35,76.83 4.45,78.74 SD_CON.6
  Bottom 0.406: v17.78,68.58 31.75,68.58 R39.1
SD_INT_OUT
  Top 0.406: C32.- 13.97,76.2 15.24,77.47 R46.2
  Bottom 0.406: OUT_CON.2 57.78,90.17 54.61,87 27.3,87 R46.2
SD_NOISE_VOL_A  (via drill 0.35)
  Top 0.406: SD_CON.7 3.81,74.93 v3.81,45.72
  Bottom 0.406: v3.81,45.72 35.56,45.72 36.83,46.99 R55.2
SD_SNAPPY_A
  Top 0.406: C29.2 24.13,66.04 | 24.13,66.04 24.13,55.88 23.5,55.24 23.5,45.72 24.13,45.09 24.13,39.37 C30.1 | SD_CON.4 21.59,83.82 24.13,81.28 24.13,66.04
SD_SNAPPY_B
  Top 0.406: SD_CON.5 7.62,81.28 8.89,80.01 R50.1
SD_TRIGGER  (via drill 0.35)
  Top 0.406: R38.1 R27.2 | v19.05,48.26 19.05,22.23 R36.2
  Bottom 0.406: R27.2 19.68,57.78 19.68,48.9 v19.05,48.26 | SD_CON.1 10.79,91.44 15.24,87 15.24,73.66 | R38.1 16.51,62.23 15.24,63.5 15.24,73.66 | 15.24,73.66 22.23,73.66 29.84,81.28 44.45,81.28 INT_TRG_CON.3
SD_TUNE_A
  Top 0.406: C20.2 C21.1
  Bottom 0.406: C21.1 7.62,57.15 7.62,87 5.71,88.9 SD_CON.2
SD_TUNE_B
  Bottom 0.406: R49.2 7.62,5.08 1.91,10.79 1.91,71.12 5.08,74.3 5.08,85.72 4.45,86.36 SD_CON.3

### Text on the board
tNames: -12v | +12v | TR82 mk2 / Kicks v1.1 / gerbster.nl 2022 | BD1 | BD2 | SD | Bassdrum #2 | SnareDrum | Bassdrum #1